# Altium schematic sheet 1_Controller.SchDoc
size A4; SheetNumber: 1; SheetTotal: 2
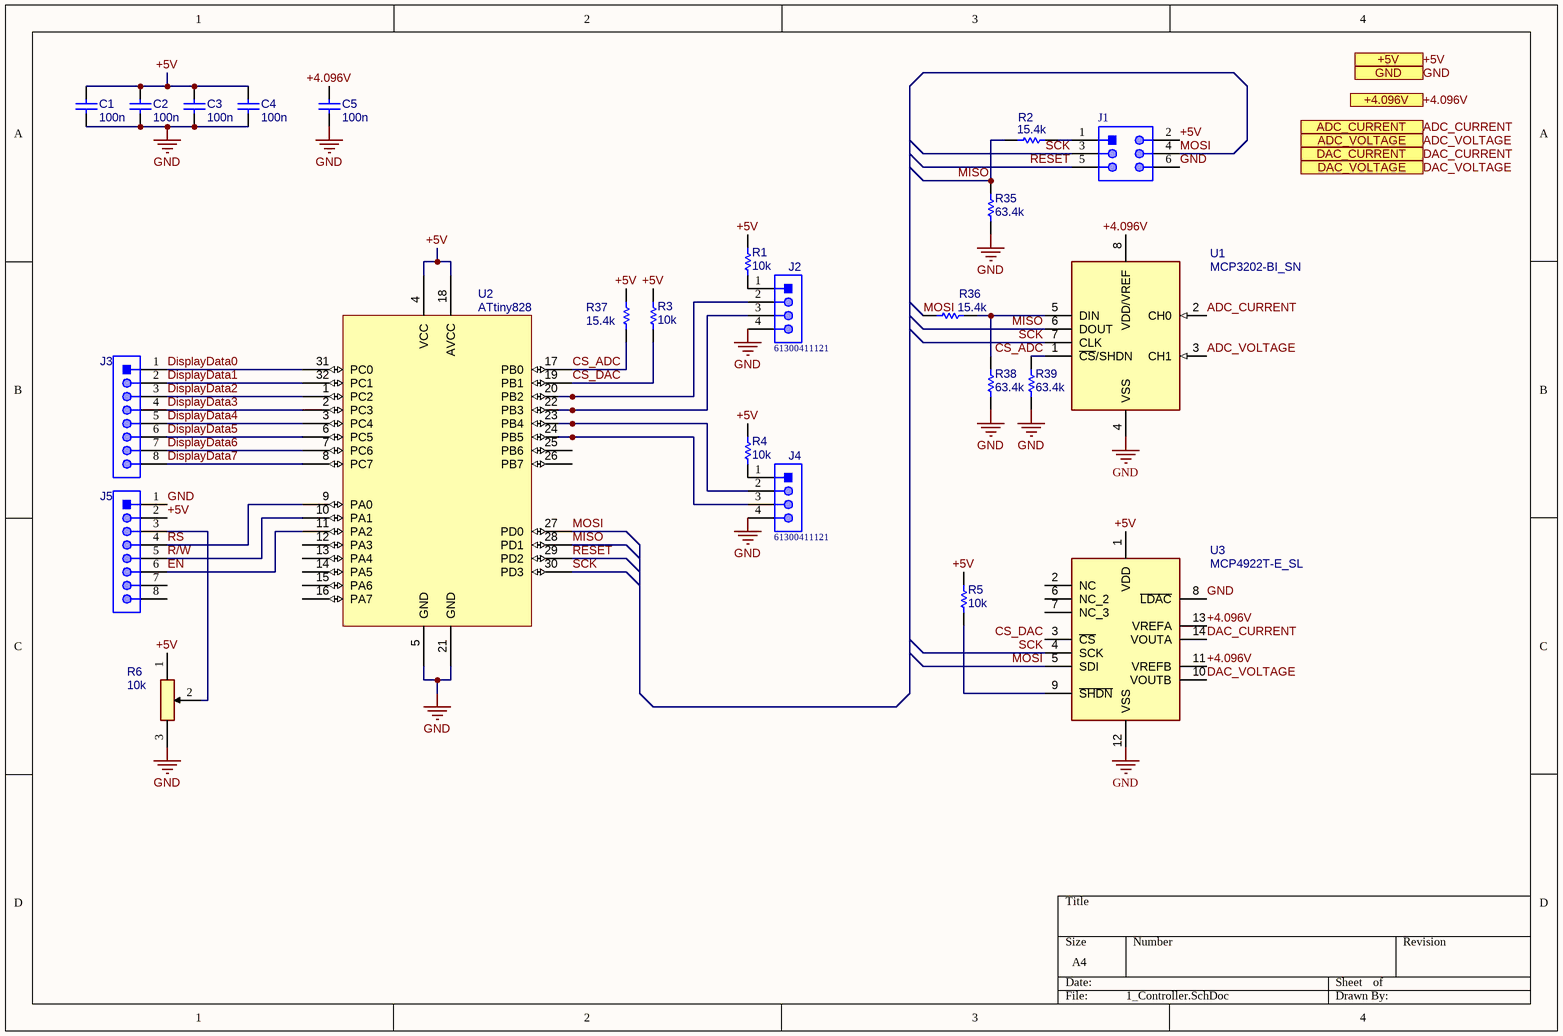
[diagram p0: 1_Controller.SchDoc]

## Parts
C1  value 100n  [6-0805_N]  (hidden comment: Capacitor)
C2  value 100n  [6-0805_N]  (hidden comment: Capacitor)
C3  value 100n  [6-0805_N]  (hidden comment: Capacitor)
C4  value 100n  [6-0805_N]  (hidden comment: Capacitor)
C5  value 100n  [6-0805_N]  (hidden comment: Capacitor)
J1  61300621121  [61300621121]  (value not drawn)
J2  61300411121  [61300411121]
J3  61300811121  [61300811121]  (value not drawn)
J4  61300411121  [61300411121]
J5  61300811121  [61300811121]  (value not drawn)
R1  value 10k  [6-0805_N]  (hidden comment: Resistor)
R2  value 15.4k  [6-0805_N]  (hidden comment: Resistor)
R3  value 10k  [6-0805_N]  (hidden comment: Resistor)
R4  value 10k  [6-0805_N]  (hidden comment: Resistor)
R5  value 10k  [6-0805_N]  (hidden comment: Resistor)
R6  10k  [PV36W201C01B00]
R35  value 63.4k  [6-0805_N]  (hidden comment: Resistor)
R36  value 15.4k  [6-0805_N]  (hidden comment: Resistor)
R37  value 15.4k  [6-0805_N]  (hidden comment: Resistor)
R38  value 63.4k  [6-0805_N]  (hidden comment: Resistor)
R39  value 63.4k  [6-0805_N]  (hidden comment: Resistor)
U1  MCP3202-BI_SN  [SOIC127P600X175-8N]
U2  ATtiny828  [QFP80P900X900X120-32N]
U3  MCP4922T-E_SL  [SOIC127P600X175-14N]

## Ports
+4.096V (see 2_PSU[4A]), +5V (see 2_PSU[4A]), ADC_CURRENT (see 2_PSU[4A]), ADC_VOLTAGE (see 2_PSU[4A]), DAC_CURRENT (see 2_PSU[4A]), DAC_VOLTAGE (see 2_PSU[4A]), GND (see 2_PSU[4A])

## Nets
GND: C1.1 C2.1 C3.1 C4.1 C5.1 J1.6 J2.4 J4.4 J5.1 R6.3(CW) R35.1 R38.1 R39.1 U1.4(VSS) U2.5(GND) U2.21(GND) U3.8(~{LDAC}) U3.12(VSS) ; port GND
+4.096V: C5.2 U1.8(VDD/VREF) U3.11(VREFB) U3.13(VREFA) ; port +4.096V
+5V: C1.2 C2.2 C3.2 C4.2 J1.2 J5.2 R1.2 R3.2 R4.2 R5.2 R6.1(CCW) R37.1 U2.4(VCC) U2.18(AVCC) U3.1(VDD) ; port +5V
ADC_CURRENT: U1.2(CH0) ; port ADC_CURRENT
ADC_VOLTAGE: U1.3(CH1) ; port ADC_VOLTAGE
CS_ADC: R37.2 R39.2 U1.1(~{CS}/SHDN) U2.17(PB0)
CS_DAC: R3.1 U2.19(PB1) U3.3(~{CS})
DAC_CURRENT: U3.14(VOUTA) ; port DAC_CURRENT
DAC_VOLTAGE: U3.10(VOUTB) ; port DAC_VOLTAGE
DisplayData0: J3.1 U2.31(PC0)
DisplayData1: J3.2 U2.32(PC1)
DisplayData2: J3.3 U2.1(PC2)
DisplayData3: J3.4 U2.2(PC3)
DisplayData4: J3.5 U2.3(PC4)
DisplayData5: J3.6 U2.6(PC5)
DisplayData6: J3.7 U2.7(PC6)
DisplayData7: J3.8 U2.8(PC7)
EN: J5.6 U2.11(PA2)
MISO: R2.2 R35.2 U1.6(DOUT) U2.28(PD1)
MOSI: J1.4 R36.2 U2.27(PD0) U3.5(SDI)
R/W: J5.5 U2.10(PA1)
RESET: J1.5 U2.29(PD2)
RS: J5.4 U2.9(PA0)
SCK: J1.3 U1.7(CLK) U2.30(PD3) U3.4(SCK)
NetJ1_1: J1.1 R2.1
NetJ2_1: J2.1 R1.1
NetJ2_2: J2.2 U2.20(PB2)
NetJ2_3: J2.3 U2.22(PB3)
NetJ4_1: J4.1 R4.1
NetJ4_2: J4.2 U2.23(PB4)
NetJ4_3: J4.3 U2.24(PB5)
NetJ5_3: J5.3 R6.2(WIPER)
NetR5_1: R5.1 U3.9(~{SHDN})
NetR36_1: R36.1 R38.2 U1.5(DIN)

Not connected (* = marked no-connect by the designer): J5 7 8; U2 12(PA3) 13(PA4) 14(PA5) 15(PA6) 16(PA7) 25(PB6) 26(PB7); U3 2(NC) 6(NC_2) 7(NC_3)

## Library data of the parts
C1-C5 = Capacitor: SimulationGenericComponent: True
J1 = CMP-1502-01072-1: THT Vertical Pin Header WR-PHD, Pitch 2.54 mm, Dual Row, 6 pins; Manufacturer: Wurth Elektronik; Contact Resistance: 20mOhm; Withstanding Voltage: 500VAC; Pin Number: 6; Gender: Male; Pitch: 2.54mm; Working Voltage: 250VAC; Rated Current: 3A; Packaging: Bag; Row Number: Dual; Manufacturer URL: http://www.we-online.de; Part Number: 61300621121; Operating Temperature: -40to105degC; Mounting Technology: THT; Package Reference: 61300621121; Datasheet URL: https://katalog.we-online.de/em/datasheet/6130xx21121.pdf; Orientation: Vertical; Publisher: WurthElektronik
J2 J4 = CMP-1502-01064-1: THT Vertical Pin Header WR-PHD, Pitch 2.54 mm, Single Row, 4 pins; Manufacturer: Wurth Elektronik; Withstanding Voltage: 500VAC; Rated Current: 3A; Working Voltage: 250VAC; Pin Number: 4; Gender: Male; Contact Resistance: 20mOhm; Pitch: 2.54mm; Manufacturer URL: http://www.we-online.de; Operating Temperature: -40to105degC; Packaging: Bag; Mounting Technology: THT; Package Reference: 61300411121; Datasheet URL: https://katalog.we-online.de/em/datasheet/6130xx11121.pdf; Publisher: WurthElektronik; Part Number: 61300411121; Row Number: Single; Orientation: Vertical
J3 J5 = CMP-1502-01076-1: THT Vertical Pin Header WR-PHD, Pitch 2.54 mm, Single Row, 8 pins; Manufacturer: Wurth Elektronik; Rated Current: 3A; Pin Number: 8; Working Voltage: 250VAC; Gender: Male; Contact Resistance: 20mOhm; Pitch: 2.54mm; Withstanding Voltage: 500VAC; Publisher: WurthElektronik; Operating Temperature: -40to105degC; Orientation: Vertical; Row Number: Single; Part Number: 61300811121; Package Reference: 61300811121; Mounting Technology: THT; Packaging: Bag; Manufacturer URL: http://www.we-online.de; Datasheet URL: https://katalog.we-online.de/em/datasheet/6130xx11121.pdf
R1-R5 R35-R39 = Resistor: TC1: 0; SimulationGenericComponent: True; TC2: 0
R6 = PV36W104C01B00: Variable Resistor; Manufacturer_Name: Bourns; Datasheet Link: https://www.bourns.com/docs/Product-Datasheets/pv36.pdf; Height: 10.03mm; Manufacturer_Part_Number: PV36W104C01B00; Mouser Part Number: 81-PV36W104C01B00; Mouser Price/Stock: https://www.mouser.co.uk/ProductDetail/Bourns/PV36W104C01B00?qs=ifmdR88tEJ9s2DMKM%252Bry%252BA%3D%3D; Arrow Part Number: PV36W104C01B00; Arrow Price/Stock: https://www.arrow.com/en/products/pv36w104c01b00/bourns?region=nac
U1 = MCP3202-BI_SN: Integrated Circuit; Manufacturer_Name: Microchip; Manufacturer_Part_Number: MCP3202-BI/SN; Datasheet Link: https://datasheet.datasheetarchive.com/originals/distributors/Datasheets-19/DSA-360813.pdf; Height: 1.75mm; Mouser Part Number: 579-MCP3202BISN; Mouser Price/Stock: https://www.mouser.co.uk/ProductDetail/Microchip-Technology-Atmel/MCP3202-BI-SN?qs=C%252BuF95oynlkGMhp5%2FSqbew%3D%3D; Arrow Part Number: MCP3202-BI/SN; Arrow Price/Stock: https://www.arrow.com/en/products/mcp3202-bisn/microchip-technology?region=nac
U2 = ATtiny828: Microchip ATtiny828 AVR MCU
U3 = MCP4922T-E_SL: Undefined or Miscellaneous; Manufacturer_Name: Microchip; Manufacturer_Part_Number: MCP4922T-E/SL; Datasheet Link: http://ww1.microchip.com/downloads/en/DeviceDoc/22250A.pdf; Height: 1.75mm; Mouser Part Number: 579-MCP4922T-E/SL; Mouser Price/Stock: https://www.mouser.co.uk/ProductDetail/Microchip-Technology-Atmel/MCP4922T-E-SL?qs=8U9qMIGhlkqc26Xt7UKk2w%3D%3D; Arrow Part Number: MCP4922T-E/SL; Arrow Price/Stock: https://www.arrow.com/en/products/mcp4922t-esl/microchip-technology?region=nac